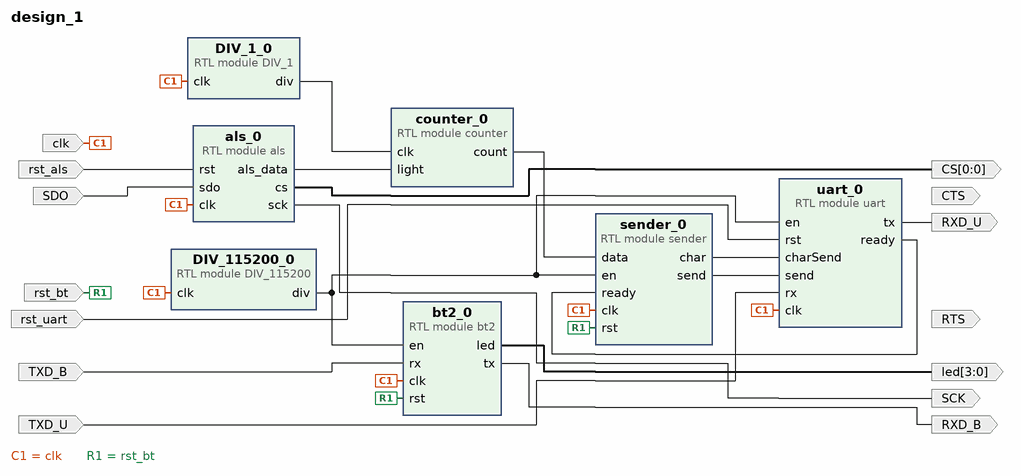
[diagram p0: block diagram of the top level]
# Vivado block design design_1, xc7z010clg400-1, Vivado 2018.2
create_bd_design design_1

create_bd_port -dir O CTS
create_bd_port -dir O RTS
create_bd_port -dir I clk
create_bd_port -dir I rst_uart
create_bd_port -dir I rst_bt
create_bd_port -dir I rst_als
create_bd_port -dir I SDO
create_bd_port -dir O -from 0 -to 0 CS
create_bd_port -dir O SCK
create_bd_port -dir O -from 3 -to 0 led
create_bd_port -dir I TXD_U
create_bd_port -dir I TXD_B
create_bd_port -dir O RXD_B
create_bd_port -dir O RXD_U

create_bd_cell -type module -reference bt2 bt2_0
create_bd_cell -type module -reference DIV_1 DIV_1_0
create_bd_cell -type module -reference DIV_115200 DIV_115200_0
create_bd_cell -type module -reference sender sender_0
create_bd_cell -type module -reference uart uart_0
create_bd_cell -type module -reference counter counter_0
create_bd_cell -type module -reference als als_0

# ---- connections ----

connect_bd_net [get_bd_ports clk] \
  [get_bd_pins sender_0/clk] [get_bd_pins uart_0/clk] [get_bd_pins DIV_115200_0/clk] [get_bd_pins bt2_0/clk] \
  [get_bd_pins DIV_1_0/clk] [get_bd_pins als_0/clk]
connect_bd_net [get_bd_ports rst_uart] [get_bd_pins uart_0/rst]
connect_bd_net [get_bd_ports rst_bt] [get_bd_pins bt2_0/rst] [get_bd_pins sender_0/rst]
connect_bd_net [get_bd_ports rst_als] [get_bd_pins als_0/rst]
connect_bd_net [get_bd_ports SDO] [get_bd_pins als_0/sdo]
connect_bd_net [get_bd_pins DIV_115200_0/div] [get_bd_pins uart_0/en] [get_bd_pins sender_0/en] [get_bd_pins bt2_0/en]
connect_bd_net [get_bd_pins DIV_1_0/div] [get_bd_pins counter_0/clk]
connect_bd_net [get_bd_pins als_0/als_data] [get_bd_pins counter_0/light]
connect_bd_net [get_bd_pins als_0/cs] [get_bd_ports CS]
connect_bd_net [get_bd_pins als_0/sck] [get_bd_ports SCK]
connect_bd_net [get_bd_pins bt2_0/led] [get_bd_ports led]
connect_bd_net [get_bd_pins counter_0/count] [get_bd_pins sender_0/data]
connect_bd_net [get_bd_ports TXD_U] [get_bd_pins uart_0/rx]
connect_bd_net [get_bd_ports TXD_B] [get_bd_pins bt2_0/rx]
connect_bd_net [get_bd_pins bt2_0/tx] [get_bd_ports RXD_B]
connect_bd_net [get_bd_pins uart_0/tx] [get_bd_ports RXD_U]
connect_bd_net [get_bd_pins uart_0/ready] [get_bd_pins sender_0/ready]
connect_bd_net [get_bd_pins sender_0/char] [get_bd_pins uart_0/charSend]
connect_bd_net [get_bd_pins sender_0/send] [get_bd_pins uart_0/send]

validate_bd_design
save_bd_design
